# Altium project gl-axt1800-jtag-adapter.PrjPcb
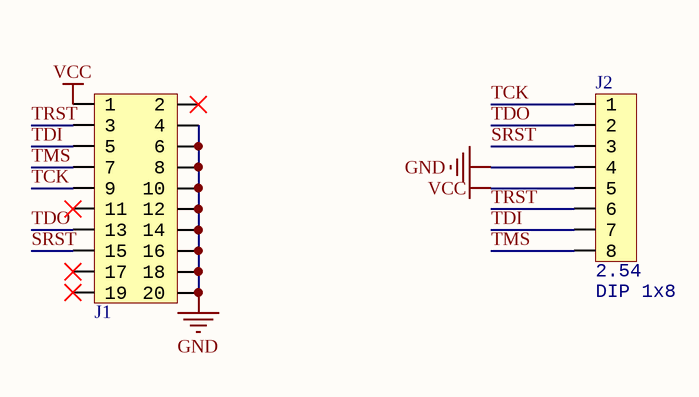
[diagram p0: Sheet1.SchDoc]
1 sheet, 2 parts. Net scope: global (net labels, ports and power ports of the same name join across sheets).
Board file: PCB1.PcbDoc

## Sheet Sheet1.SchDoc
size A4; SheetNumber: 1; SheetTotal: 1

### Parts
J1  HDR2x10  [JTAG-20P-2.54]  (value not drawn)
J2  value 2.54  Type: DIP 1x8  [HDR1X8_2.54_180F]  (hidden comment: HDR1x8)

### Nets
GND: J1.4 J1.6 J1.8 J1.10 J1.12 J1.14 J1.16 J1.18 J1.20 J2.4
VCC: J1.1 J2.5
SRST: J1.15 J2.3
TCK: J1.9 J2.1
TDI: J1.5 J2.7
TDO: J1.13 J2.2
TMS: J1.7 J2.8
TRST: J1.3 J2.6

Not connected (* = marked no-connect by the designer): J1 2* 11* 17* 19*

### Library data of the parts
J1 = HDR2x10_2.54: Header
J2 = HDR1x8_2.54: Header